# EasyEDA schematic RGB灯原理图.json
TITLE: Sheet_1; REV: 1.0; Date: 2022-01-31; Sheet: 1/1; Drawn By: FranHawk; Company: Your Company
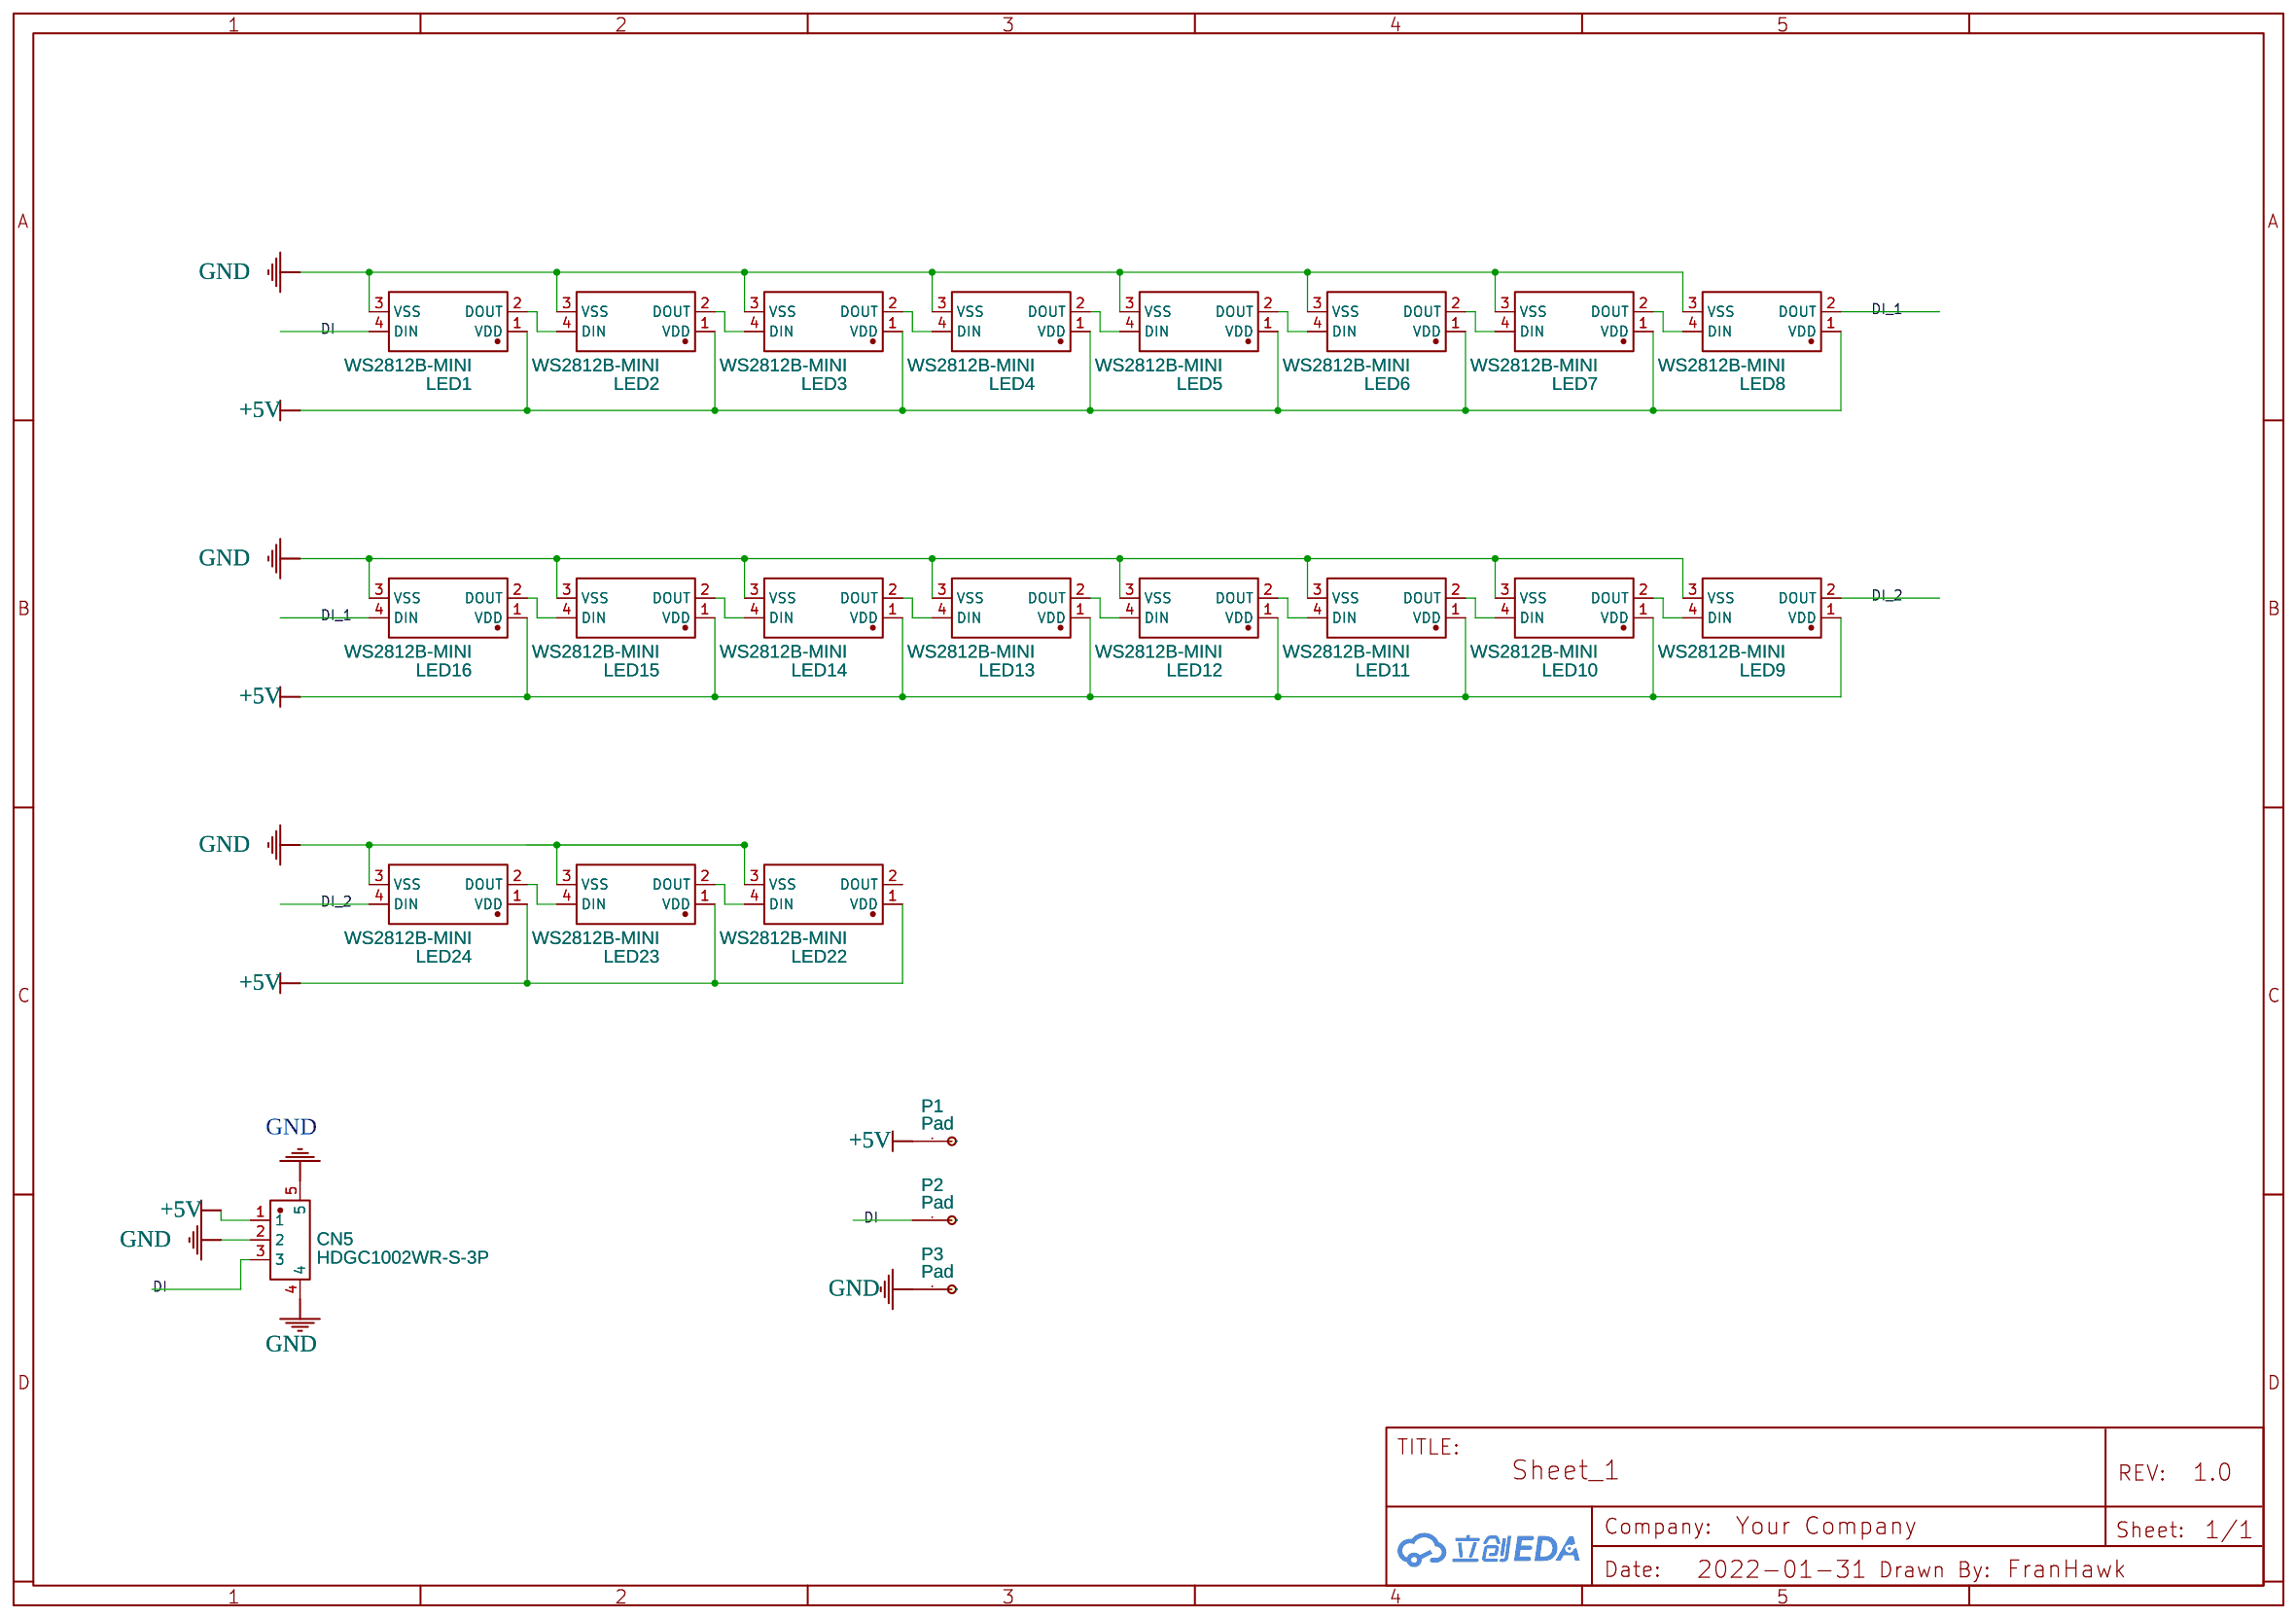
[diagram p0: schematic sheet]

## Parts
CN5  HDGC1002WR-S-3P  [CONN-SMD_3P-P1.00_HDGC_HDGC1002WR-S-3P]
LED1  WS2812B-MINI  [LED-SMD_4P-L3.5-W3.5-TL_WS2812B]
LED2  WS2812B-MINI  [LED-SMD_4P-L3.5-W3.5-TL_WS2812B]
LED3  WS2812B-MINI  [LED-SMD_4P-L3.5-W3.5-TL_WS2812B]
LED4  WS2812B-MINI  [LED-SMD_4P-L3.5-W3.5-TL_WS2812B]
LED5  WS2812B-MINI  [LED-SMD_4P-L3.5-W3.5-TL_WS2812B]
LED6  WS2812B-MINI  [LED-SMD_4P-L3.5-W3.5-TL_WS2812B]
LED7  WS2812B-MINI  [LED-SMD_4P-L3.5-W3.5-TL_WS2812B]
LED8  WS2812B-MINI  [LED-SMD_4P-L3.5-W3.5-TL_WS2812B]
LED9  WS2812B-MINI  [LED-SMD_4P-L3.5-W3.5-TL_WS2812B]
LED10  WS2812B-MINI  [LED-SMD_4P-L3.5-W3.5-TL_WS2812B]
LED11  WS2812B-MINI  [LED-SMD_4P-L3.5-W3.5-TL_WS2812B]
LED12  WS2812B-MINI  [LED-SMD_4P-L3.5-W3.5-TL_WS2812B]
LED13  WS2812B-MINI  [LED-SMD_4P-L3.5-W3.5-TL_WS2812B]
LED14  WS2812B-MINI  [LED-SMD_4P-L3.5-W3.5-TL_WS2812B]
LED15  WS2812B-MINI  [LED-SMD_4P-L3.5-W3.5-TL_WS2812B]
LED16  WS2812B-MINI  [LED-SMD_4P-L3.5-W3.5-TL_WS2812B]
LED22  WS2812B-MINI  [LED-SMD_4P-L3.5-W3.5-TL_WS2812B]
LED23  WS2812B-MINI  [LED-SMD_4P-L3.5-W3.5-TL_WS2812B]
LED24  WS2812B-MINI  [LED-SMD_4P-L3.5-W3.5-TL_WS2812B]
P1  Pad  [测试点2MM]
P2  Pad  [测试点2MM]
P3  Pad  [测试点2MM]

## Library data of the parts
CN5 = HDGC1002WR-S-3P: Supplier: LCSC; Supplier Part: C2936213; Manufacturer: HDGC(华德共创); Contributor: LCSC
LED1-LED16 LED22-LED24 = WS2812B-MINI: Supplier: LCSC; Supplier Part: C527089; Manufacturer: Worldsemi; Manufacturer Part: WS2812B-Mini; Contributor: LCSC; JLCPCB Part Class: Extended Part
P1-P3 = Pad: Contributor: AHBDYWTX

## Nets
+5V: CN5.1 LED1.1(VDD) LED2.1(VDD) LED3.1(VDD) LED4.1(VDD) LED5.1(VDD) LED6.1(VDD) LED7.1(VDD) LED8.1(VDD) LED9.1(VDD) LED10.1(VDD) LED11.1(VDD) LED12.1(VDD) LED13.1(VDD) LED14.1(VDD) LED15.1(VDD) LED16.1(VDD) LED22.1(VDD) LED23.1(VDD) LED24.1(VDD) P1.1
GND: CN5.2 CN5.4 CN5.5 LED1.3(VSS) LED2.3(VSS) LED3.3(VSS) LED4.3(VSS) LED5.3(VSS) LED6.3(VSS) LED7.3(VSS) LED8.3(VSS) LED9.3(VSS) LED10.3(VSS) LED11.3(VSS) LED12.3(VSS) LED13.3(VSS) LED14.3(VSS) LED15.3(VSS) LED16.3(VSS) LED22.3(VSS) LED23.3(VSS) LED24.3(VSS) P3.1
DI: CN5.3 LED1.4(DIN) P2.1
DI_1: LED8.2(DOUT) LED16.4(DIN)
DI_2: LED9.2(DOUT) LED24.4(DIN)
Net-(LED1-2): LED1.2(DOUT) LED2.4(DIN)
Net-(LED2-2): LED2.2(DOUT) LED3.4(DIN)
Net-(LED3-2): LED3.2(DOUT) LED4.4(DIN)
Net-(LED4-2): LED4.2(DOUT) LED5.4(DIN)
Net-(LED5-2): LED5.2(DOUT) LED6.4(DIN)
Net-(LED6-2): LED6.2(DOUT) LED7.4(DIN)
Net-(LED7-2): LED7.2(DOUT) LED8.4(DIN)
Net-(LED9-4): LED9.4(DIN) LED10.2(DOUT)
Net-(LED10-4): LED10.4(DIN) LED11.2(DOUT)
Net-(LED11-4): LED11.4(DIN) LED12.2(DOUT)
Net-(LED12-4): LED12.4(DIN) LED13.2(DOUT)
Net-(LED13-4): LED13.4(DIN) LED14.2(DOUT)
Net-(LED14-4): LED14.4(DIN) LED15.2(DOUT)
Net-(LED15-4): LED15.4(DIN) LED16.2(DOUT)
Net-(LED22-4): LED22.4(DIN) LED23.2(DOUT)
Net-(LED23-4): LED23.4(DIN) LED24.2(DOUT)

Not connected (* = marked no-connect by the designer): LED22 2(DOUT)
